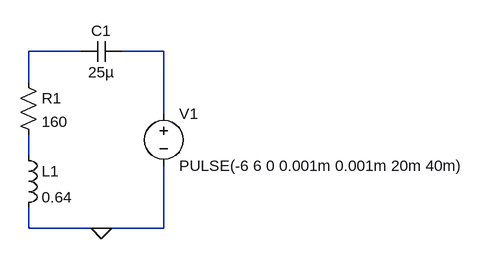
[diagram p0: schematic tran3.asc]
tran3.asc, the LTspice schematic file:
Version 4
SHEET 1 880 680
WIRE 192 64 112 64
WIRE 320 64 256 64
WIRE 112 112 112 64
WIRE 320 160 320 64
WIRE 112 224 112 192
WIRE 112 336 112 304
WIRE 224 336 112 336
WIRE 320 336 320 240
WIRE 320 336 224 336
FLAG 224 336 0
SYMBOL res 96 96 R0
SYMATTR InstName R1
SYMATTR Value 160
SYMBOL cap 256 48 R90
WINDOW 0 0 32 VBottom 2
WINDOW 3 32 32 VTop 2
SYMATTR InstName C1
SYMATTR Value 25µ
SYMBOL ind 96 208 R0
SYMATTR InstName L1
SYMATTR Value 0.64
SYMBOL voltage 320 144 R0
WINDOW 123 0 0 Left 0
WINDOW 39 0 0 Left 0
SYMATTR InstName V1
SYMATTR Value PULSE(-6 6 0 0.001m 0.001m 20m 40m)

The netlist it stands for:
* tran3.asc
R1 N001 N003 160
C1 N002 N001 25µ
L1 N003 0 0.64
V1 N002 0 PULSE(-6 6 0 0.001m 0.001m 20m 40m)
.backanno
.end